# Altium project ros_bridge_module.PrjPcb
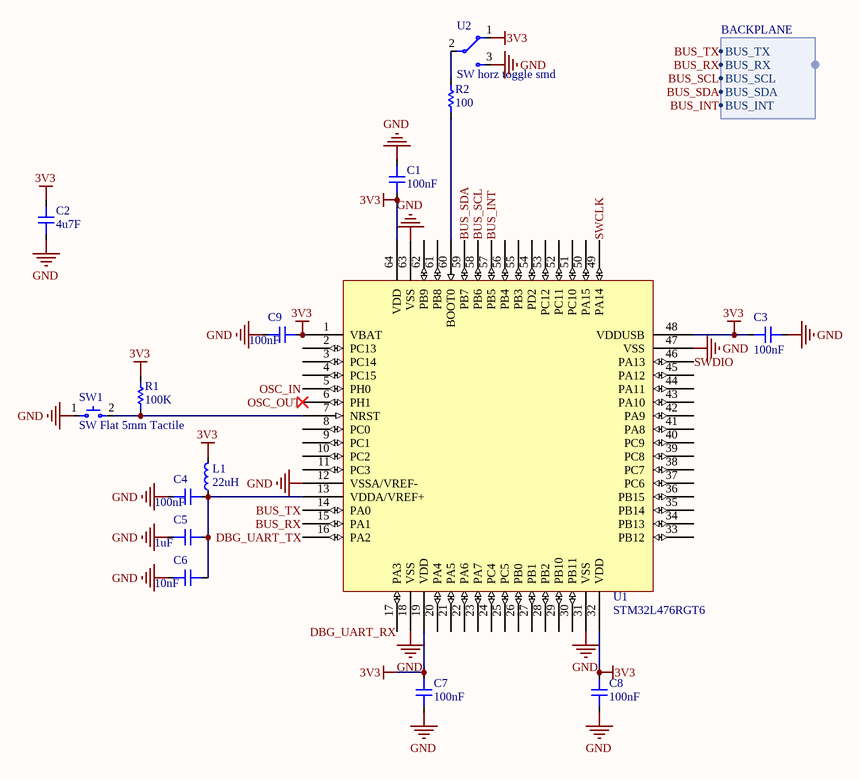
[diagram p0: STM32.SchDoc]
2 sheets, 15 parts. Net scope: strictly hierarchical (ports join the sheet entries above them; power ports are local).
Sheets:
  main.SchDoc
  STM32.SchDoc

## Sheet main.SchDoc
size A

## Sheet STM32.SchDoc
size A

### Parts
C1  100nF  [CAP 0805 L]
C2  4u7F  [CAP 0805 L]
C3  100nF  [CAP 0805 L]
C4  100nF  [CAP 0805 L]
C5  1uF  [CAP 0805 L]
C6  10nF  [CAP 0805 L]
C7  100nF  [CAP 0805 L]
C8  100nF  [CAP 0805 L]
C9  100nF  [CAP 0805 L]
L1  22uH  [IND 0805 L]
R1  100K  [RES 0603 L]
R2  100  [RES 0603 L]
SW1  SW Flat 5mm Tactile  [SW 5MM TACTILE]
U1  STM32L476RGT6  [LQFP64]
U2  SW horz toggle smd

### Harnesses
BACKPLANE: BUS_TX, BUS_RX, BUS_SCL, BUS_SDA, BUS_INT

### Nets
3V3: C1.2 C2.1 C3.2 C7.2 C8.2 C9.2 L1.2 R1.2 U1.1(VBAT) U1.19(VDD) U1.32(VDD) U1.48(VDDUSB) U1.64(VDD) U2.1
GND: C1.1 C2.2 C3.1 C4.1 C5.1 C6.1 C7.1 C8.1 C9.1 SW1.1 U1.12(VSSA/VREF-) U1.18(VSS) U1.31(VSS) U1.47(VSS) U1.63(VSS) U2.3
BUS_INT: U1.57(PB5) ; harness BACKPLANE.BUS_INT
BUS_RX: U1.15(PA1) ; harness BACKPLANE.BUS_RX
BUS_SCL: U1.58(PB6) ; harness BACKPLANE.BUS_SCL
BUS_SDA: U1.59(PB7) ; harness BACKPLANE.BUS_SDA
BUS_TX: U1.14(PA0) ; harness BACKPLANE.BUS_TX
DBG_UART_RX: U1.17(PA3)
DBG_UART_TX: U1.16(PA2)
OSC_IN: U1.5(PH0)
OSC_OUT: U1.6(PH1)
SWCLK: U1.49(PA14)
SWDIO: U1.46(PA13)
NetC4_2: C4.2 C5.2 C6.2 L1.1 U1.13(VDDA/VREF+)
NetR1_1: R1.1 SW1.2 U1.7(NRST)
NetR2_1: R2.1 U1.60(BOOT0)
NetR2_2: R2.2 U2.2

Not connected (* = marked no-connect by the designer): U1 2(PC13) 3(PC14) 4(PC15) 8(PC0) 9(PC1) 10(PC2) 11(PC3) 20(PA4) 21(PA5) 22(PA6) 23(PA7) 24(PC4) 25(PC5) 26(PB0) 27(PB1) 28(PB2) 29(PB10) 30(PB11) 33(PB12) 34(PB13) 35(PB14) 36(PB15) 37(PC6) 38(PC7) 39(PC8) 40(PC9) 41(PA8) 42(PA9) 43(PA10) 44(PA11) 45(PA12) 50(PA15) 51(PC10) 52(PC11) 53(PC12) 54(PD2) 55(PB3) 56(PB4) 61(PB8) 62(PB9)

### Library data of the parts
C1-C9 = CAP 0805
L1 = IND 0805
R1 R2 = RES 0603